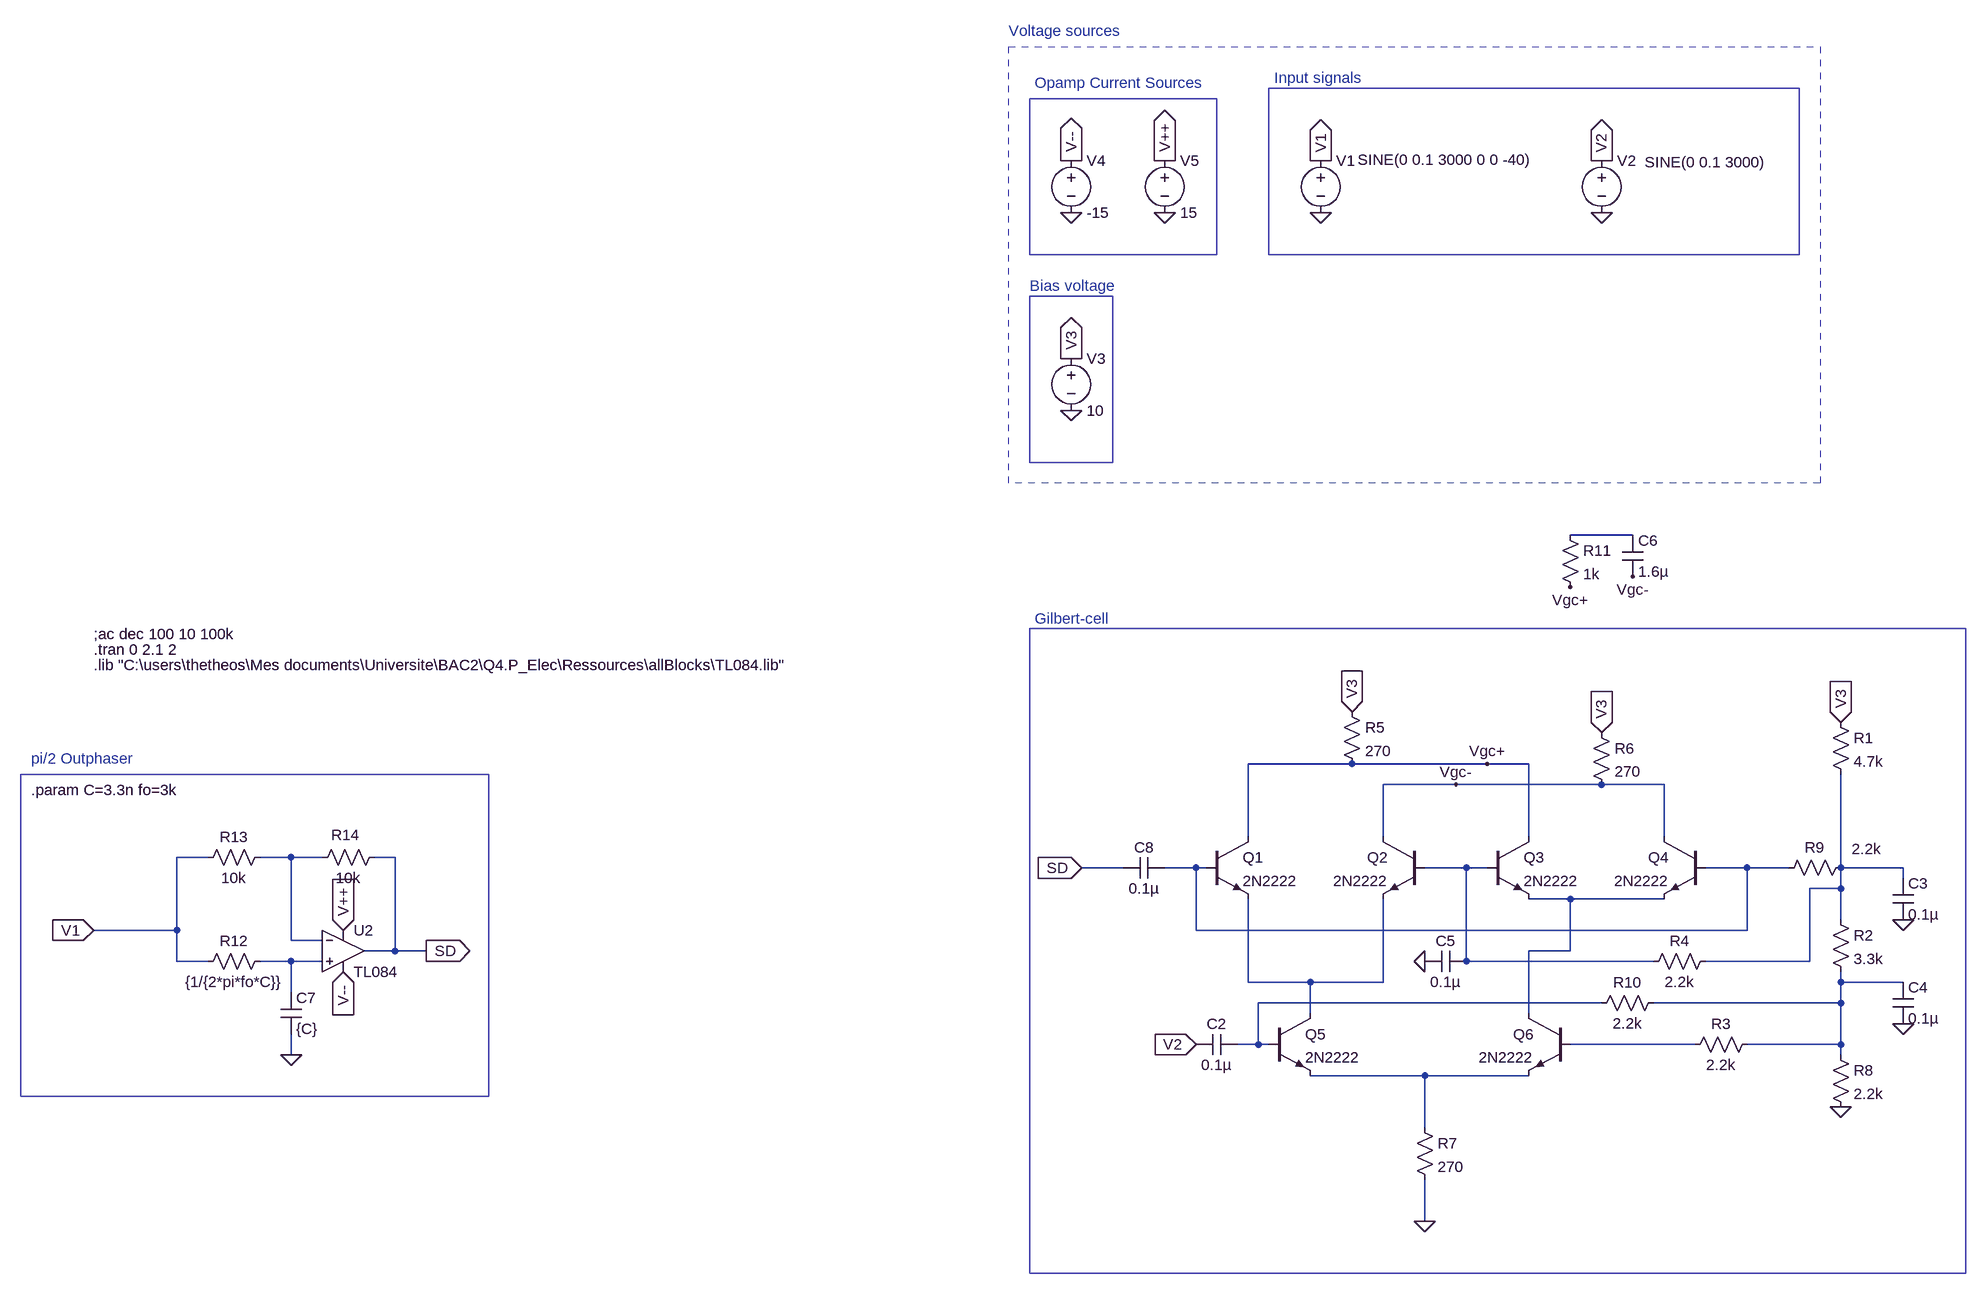
[diagram p0: schematic gilber_cell.asc]
gilber_cell.asc, the LTspice schematic file:
Version 4
SHEET 1 1172 788
WIRE 656 -352 560 -352
WIRE 224 0 64 0
WIRE 432 0 224 0
WIRE 496 0 432 0
WIRE 384 32 272 32
WIRE 608 32 384 32
WIRE 704 32 608 32
WIRE 64 112 64 0
WIRE 272 112 272 32
WIRE 496 112 496 0
WIRE 704 112 704 32
WIRE -1536 144 -1584 144
WIRE -1408 144 -1456 144
WIRE -1360 144 -1408 144
WIRE -1248 144 -1280 144
WIRE -128 160 -192 160
WIRE -16 160 -64 160
WIRE 0 160 -16 160
WIRE 400 160 336 160
WIRE 432 160 400 160
WIRE 832 160 768 160
WIRE 896 160 832 160
WIRE 976 160 976 16
WIRE 1072 160 976 160
WIRE 1072 176 1072 160
WIRE 976 192 976 160
WIRE 976 192 928 192
WIRE 560 208 496 208
WIRE 704 208 560 208
WIRE 976 240 976 192
WIRE -1584 256 -1584 144
WIRE -1584 256 -1712 256
WIRE -16 256 -16 160
WIRE 832 256 832 160
WIRE 832 256 -16 256
WIRE -1408 272 -1408 144
WIRE -1360 272 -1408 272
WIRE -1248 288 -1248 144
WIRE -1248 288 -1296 288
WIRE -1200 288 -1248 288
WIRE 560 288 560 208
WIRE 560 288 496 288
WIRE -1584 304 -1584 256
WIRE -1536 304 -1584 304
WIRE -1408 304 -1456 304
WIRE -1360 304 -1408 304
WIRE 400 304 400 160
WIRE 688 304 400 304
WIRE 928 304 928 192
WIRE 928 304 768 304
WIRE 64 336 64 208
WIRE 160 336 64 336
WIRE 272 336 272 208
WIRE 272 336 160 336
WIRE 976 336 976 320
WIRE 1072 336 976 336
WIRE -1408 352 -1408 304
WIRE 608 368 80 368
WIRE 976 368 976 336
WIRE 976 368 688 368
WIRE 160 384 160 336
WIRE 496 384 496 288
WIRE 80 432 80 368
WIRE 80 432 48 432
WIRE 96 432 80 432
WIRE 752 432 560 432
WIRE 976 432 976 368
WIRE 976 432 832 432
WIRE -1408 448 -1408 416
WIRE 976 448 976 432
WIRE 336 480 160 480
WIRE 496 480 336 480
WIRE 336 560 336 480
WIRE 336 704 336 640
FLAG 176 -848 0
FLAG 608 -848 0
FLAG -208 -544 0
FLAG 608 -928 V2
IOPIN 608 -928 Out
FLAG -208 -624 V3
IOPIN -208 -624 Out
FLAG 176 -928 V1
IOPIN 176 -928 Out
FLAG -16 432 V2
IOPIN -16 432 In
FLAG 224 -80 V3
IOPIN 224 -80 In
FLAG 608 -48 V3
IOPIN 608 -48 In
FLAG 336 704 0
FLAG 976 528 0
FLAG 976 -64 V3
IOPIN 976 -64 In
FLAG 1072 240 0
FLAG 1072 400 0
FLAG 336 304 0
FLAG -1408 448 0
FLAG -1200 288 SD
IOPIN -1200 288 Out
FLAG -192 160 SD
IOPIN -192 160 In
FLAG -1712 256 V1
IOPIN -1712 256 In
FLAG -208 -848 0
FLAG -64 -848 0
FLAG -64 -928 V++
IOPIN -64 -928 Out
FLAG -1328 256 V++
IOPIN -1328 256 In
FLAG -208 -928 V--
IOPIN -208 -928 Out
FLAG -1328 320 V--
IOPIN -1328 320 In
FLAG 384 32 Vgc-
FLAG 432 0 Vgc+
FLAG 656 -288 Vgc-
FLAG 560 -272 Vgc+
SYMBOL npn 0 112 R0
SYMATTR InstName Q1
SYMATTR Value 2N2222
SYMBOL npn 336 112 M0
SYMATTR InstName Q2
SYMATTR Value 2N2222
SYMBOL npn 432 112 R0
SYMATTR InstName Q3
SYMATTR Value 2N2222
SYMBOL npn 768 112 M0
SYMATTR InstName Q4
SYMATTR Value 2N2222
SYMBOL npn 96 384 R0
SYMATTR InstName Q5
SYMATTR Value 2N2222
SYMBOL npn 560 384 M0
SYMATTR InstName Q6
SYMATTR Value 2N2222
SYMBOL voltage 176 -944 R0
WINDOW 123 0 0 Left 0
WINDOW 39 0 0 Left 0
WINDOW 3 57 14 Left 2
SYMATTR Value SINE(0 0.1 3000 0 0 -40)
SYMATTR InstName V1
SYMBOL voltage 608 -944 R0
WINDOW 123 0 0 Left 0
WINDOW 39 0 0 Left 0
WINDOW 3 66 18 Left 2
SYMATTR Value SINE(0 0.1 3000)
SYMATTR InstName V2
SYMBOL voltage -208 -640 R0
WINDOW 123 0 0 Left 0
WINDOW 39 0 0 Left 0
SYMATTR InstName V3
SYMATTR Value 10
SYMBOL cap 48 416 R90
WINDOW 0 0 32 VBottom 2
WINDOW 3 32 32 VTop 2
SYMATTR InstName C2
SYMATTR Value 0.1µ
SYMBOL res 208 -96 R0
SYMATTR InstName R5
SYMATTR Value 270
SYMBOL res 592 -64 R0
SYMATTR InstName R6
SYMATTR Value 270
SYMBOL res 320 544 R0
SYMATTR InstName R7
SYMATTR Value 270
SYMBOL res 960 224 R0
SYMATTR InstName R2
SYMATTR Value 3.3k
SYMBOL res 960 432 R0
SYMATTR InstName R8
SYMATTR Value 2.2k
SYMBOL res 848 416 R90
WINDOW 0 0 56 VBottom 2
WINDOW 3 32 56 VTop 2
SYMATTR InstName R3
SYMATTR Value 2.2k
SYMBOL res 960 -80 R0
SYMATTR InstName R1
SYMATTR Value 4.7k
SYMBOL res 784 288 R90
WINDOW 0 0 56 VBottom 2
WINDOW 3 32 56 VTop 2
SYMATTR InstName R4
SYMATTR Value 2.2k
SYMBOL res 992 144 R90
WINDOW 0 0 56 VBottom 2
WINDOW 3 -29 -24 VTop 2
SYMATTR InstName R9
SYMATTR Value 2.2k
SYMBOL cap 1056 176 R0
SYMATTR InstName C3
SYMATTR Value 0.1µ
SYMBOL cap 1056 336 R0
SYMATTR InstName C4
SYMATTR Value 0.1µ
SYMBOL cap 400 288 R90
WINDOW 0 0 32 VBottom 2
WINDOW 3 32 32 VTop 2
SYMATTR InstName C5
SYMATTR Value 0.1µ
SYMBOL res 704 352 R90
WINDOW 0 0 56 VBottom 2
WINDOW 3 32 56 VTop 2
SYMATTR InstName R10
SYMATTR Value 2.2k
SYMBOL res 544 -368 R0
SYMATTR InstName R11
SYMATTR Value 1k
SYMBOL cap 640 -352 R0
SYMATTR InstName C6
SYMATTR Value 1.6µ
SYMBOL cap -1424 352 R0
SYMATTR InstName C7
SYMATTR Value {C}
SYMBOL res -1440 288 R90
WINDOW 0 0 56 VBottom 2
WINDOW 3 32 56 VTop 2
SYMATTR InstName R12
SYMATTR Value {1/{2*pi*fo*C}}
SYMBOL res -1440 128 R90
WINDOW 0 0 56 VBottom 2
WINDOW 3 32 56 VTop 2
SYMATTR InstName R13
SYMATTR Value 10k
SYMBOL res -1264 128 R90
WINDOW 0 -3 60 VBottom 2
WINDOW 3 32 56 VTop 2
SYMATTR InstName R14
SYMATTR Value 10k
SYMBOL cap -64 144 R90
WINDOW 0 0 32 VBottom 2
WINDOW 3 32 32 VTop 2
SYMATTR InstName C8
SYMATTR Value 0.1µ
SYMBOL Opamps\\opamp2 -1328 224 R0
SYMATTR InstName U2
SYMATTR Value TL084
SYMBOL voltage -208 -944 R0
WINDOW 123 0 0 Left 0
WINDOW 39 0 0 Left 0
SYMATTR InstName V4
SYMATTR Value -15
SYMBOL voltage -64 -944 R0
WINDOW 123 0 0 Left 0
WINDOW 39 0 0 Left 0
SYMATTR InstName V5
SYMATTR Value 15
TEXT -1712 -176 Left 2 !.tran 0 2.1 2
TEXT -1808 40 Left 2 !.param C=3.3n fo=3k
TEXT -1712 -152 Left 2 !.lib "C:\\users\\thetheos\\Mes documents\\Universite\\BAC2\\Q4.P_Elec\\Ressources\\allBlocks\\TL084.lib"
TEXT -1712 -200 Left 2 !;ac dec 100 10 100k
TEXT -264 -1048 Left 2 ;Opamp Current Sources
TEXT 104 -1056 Left 2 ;Input signals
TEXT -272 -736 Left 2 ;Bias voltage
TEXT -304 -1128 Left 2 ;Voltage sources
TEXT -1808 -8 Left 2 ;pi/2 Outphaser
TEXT -264 -224 Left 2 ;Gilbert-cell
RECTANGLE Normal 16 -784 -272 -1024
RECTANGLE Normal 912 -784 96 -1040
RECTANGLE Normal -144 -464 -272 -720
RECTANGLE Normal 944 -432 -304 -1104 2
RECTANGLE Normal -1104 512 -1824 16
RECTANGLE Normal 1168 784 -272 -208

The netlist it stands for:
* gilber_cell.asc
Q1 Vgc+ N003 N008 0 2N2222
Q2 Vgc- N004 N008 0 2N2222
Q3 Vgc+ N004 N006 0 2N2222
Q4 Vgc- N003 N006 0 2N2222
Q5 N008 N010 N012 0 2N2222
Q6 N006 N011 N012 0 2N2222
V1 V1 0 SINE(0 0.1 3000 0 0 -40)
V2 V2 0 SINE(0 0.1 3000)
V3 V3 0 10
C2 N010 V2 0.1µ
R5 V3 Vgc+ 270
R6 V3 Vgc- 270
R7 N012 0 270
R2 N005 N009 3.3k
R8 N009 0 2.2k
R3 N009 N011 2.2k
R1 V3 N005 4.7k
R4 N005 N004 2.2k
R9 N005 N003 2.2k
C3 N005 0 0.1µ
C4 N009 0 0.1µ
C5 N004 0 0.1µ
R10 N009 N010 2.2k
R11 N001 Vgc+ 1k
C6 N001 Vgc- 1.6µ
C7 N007 0 {C}
R12 N007 V1 {1/{2*pi*fo*C}}
R13 N002 V1 10k
R14 SD N002 10k
C8 N003 SD 0.1µ
XU2 N007 N002 V++ V-- SD TL084  ; pins In+ In- V+ V- OUT
V4 V-- 0 -15
V5 V++ 0 15
.model NPN NPN
.model PNP PNP
.lib standard.bjt
.tran 0 2.1 2
.param C=3.3n fo=3k
.lib "C:\users\thetheos\Mes documents\Universite\BAC2\Q4.P_Elec\Ressources\allBlocks\TL084.lib"
;ac dec 100 10 100k
* Opamp Current Sources
* Input signals
* Bias voltage
* Voltage sources
* pi/2 Outphaser
* Gilbert-cell
.backanno
.end